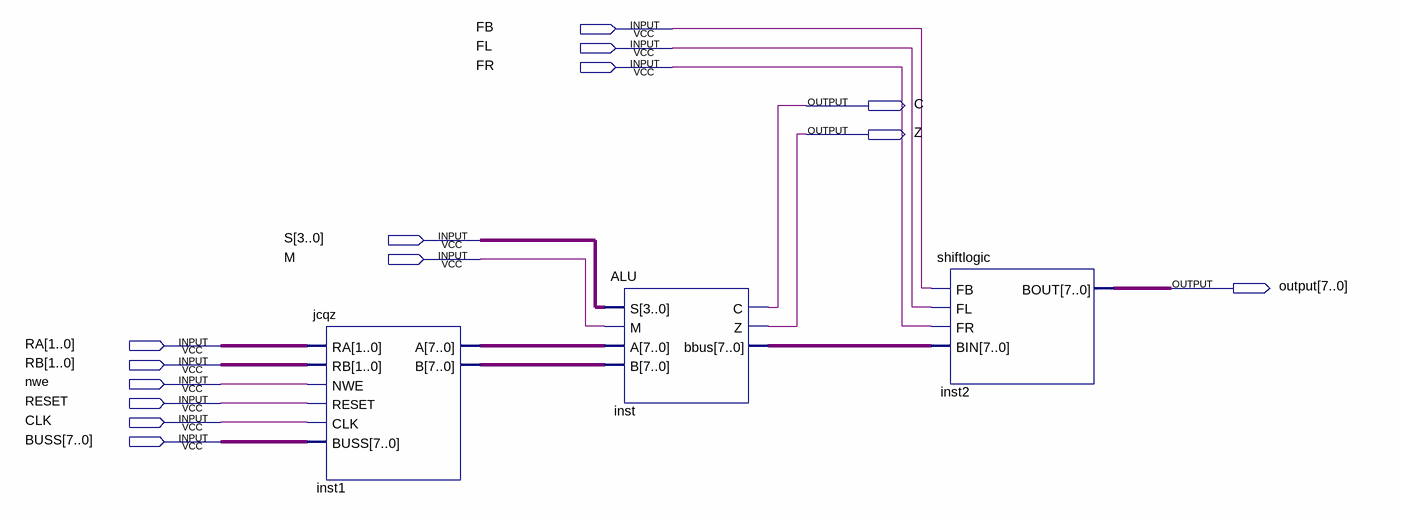
[diagram p0: schematic sheet]
// Quartus schematic part2.bdf as structural Verilog: 3 symbols, 14 pins
module part2 (
  input  FB,
  input  FL,
  input  FR,
  input  [3:0] S,
  input  M,
  input  [1:0] RA,
  input  [1:0] RB,
  input  nwe,
  input  RESET,
  input  CLK,
  input  [7:0] BUSS,
  output C,
  output Z,
  output [7:0] \output 
);

  wire [7:0] inst1_a, inst1_b, inst_bbus;

  jcqz inst1 (.RA(RA), .RB(RB), .NWE(nwe), .RESET(RESET), .CLK(CLK), .BUSS(BUSS), .A(inst1_a), .B(inst1_b));
  ALU inst (.S(S), .M(M), .A(inst1_a), .B(inst1_b), .C(C), .Z(Z), .bbus(inst_bbus));
  shiftlogic inst2 (.FB(FB), .FL(FL), .FR(FR), .BIN(inst_bbus), .BOUT(\output ));
endmodule
